# EAGLE design ESP-12F Programming Board-2 (EAGLE 7.6.0)
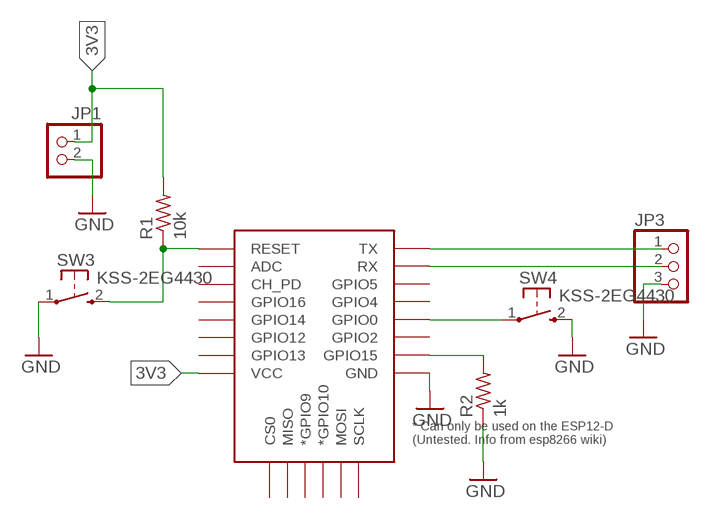
[diagram p0: schematic, sheet 1]

## Parts
JP1  PINHD-1X2  [1X02]
JP3  PINHD-1X3  [1X03]
R1  10k  R-US_R0805  [R0805]
R2  1k  R-US_R0805  [R0805]
SW3  KSS-2EG4430  [KSS-2EG4430]
SW4  KSS-2EG4430  [KSS-2EG4430]
U1  ESP12ESMD  [ESP12E-SMD]

## Nets
3V3: JP1.1 R1.2 U1.VCC
GND: JP1.2 JP3.3 R2.1 SW3.1(P) SW4.2(S) U1.GND
N$1: R1.1 SW3.2(S) U1.RESET
N$2: JP3.2 U1.RXD0(RX)
N$3: JP3.1 U1.TXD0(TX)
N$5: SW4.1(P) U1.GPIO0
N$6: R2.2 U1.GPIO15
Unconnected: U1.ADC U1.CH_PD U1.CS0 U1.GPIO2 U1.GPIO4 U1.GPIO5 U1.GPIO9(*GPIO9) U1.GPIO10(*GPIO10) U1.GPIO12 U1.GPIO13 U1.GPIO14 U1.GPIO16 U1.MISO U1.MOSI U1.SCLK

## Library data of the parts
JP1 = pinhead:PINHD-1X2: PIN HEADER
JP3 = pinhead:PINHD-1X3: PIN HEADER
R1 R2 = rcl:R-US_: RESISTOR, American symbol
SW3 SW4 = sw:KSS-2EG4430: Size: 3x6mm Height: 5mm from PCB Rating: DC12v 50mA Travel: 0.25±0.10mm Operating Force: 180±50gf Return Force: 60gf min Contact resistance: 100m? max Insulation resistance: 100M? min Operating life?50,000 cycles
U1 = esp8266modules:ESP12E: ESP12E Module

## Board
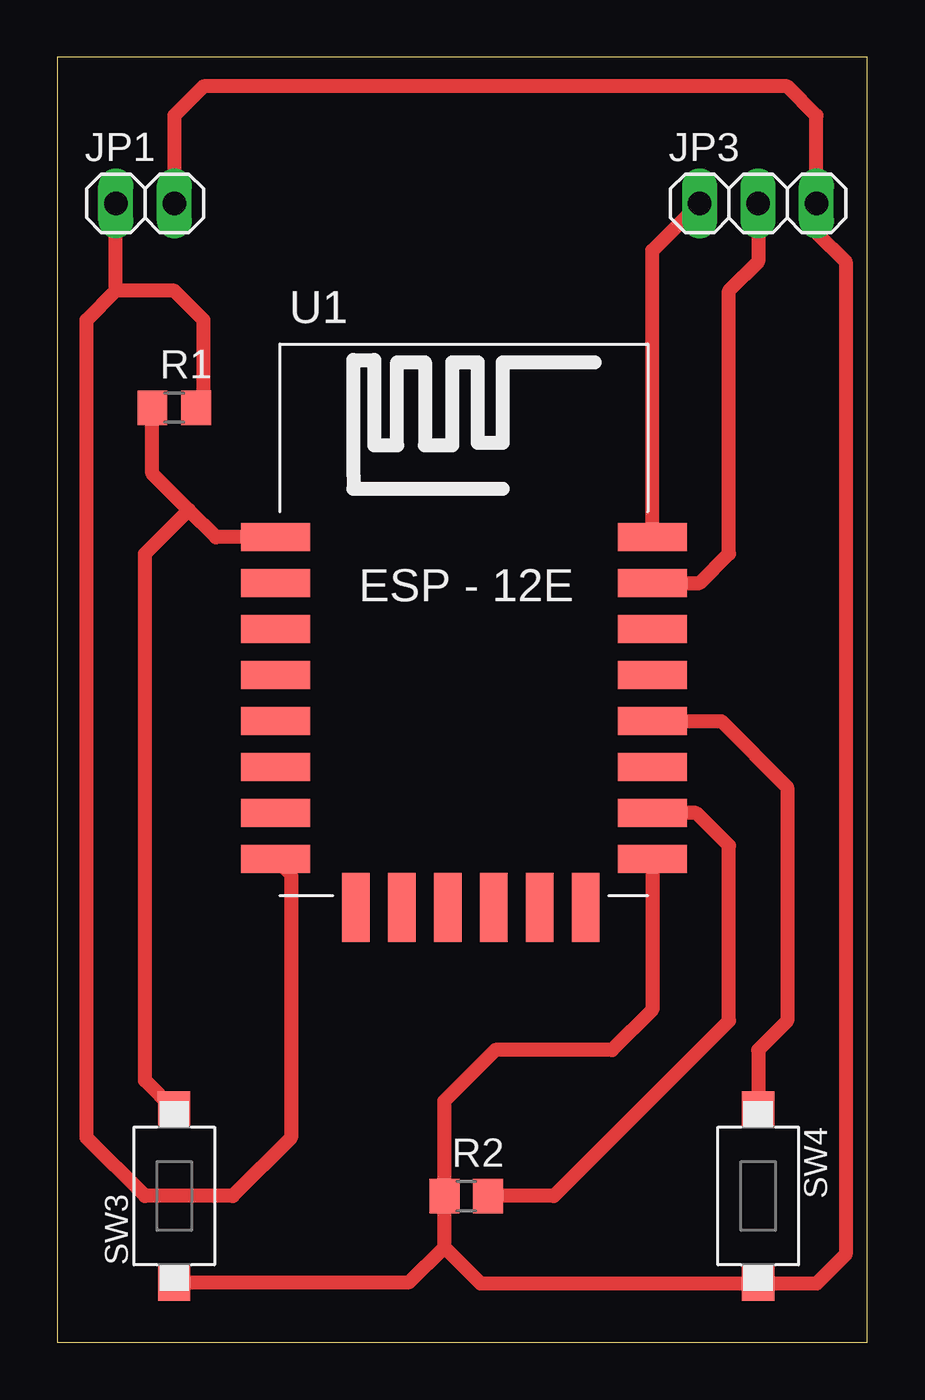
[diagram p1: board, top side]

Size 35.23 x 55.87 mm. Coordinates in mm from the lower left corner, seen from the top.
Outline: 0,0 35.23,0 35.23,55.87 0,55.87 0,0
Copper layers (1*16): Top 0.035mm / dielectric 1.5mm / Bottom 0.035mm
Design rules "default": minimum track width 10mil, minimum drill 24mil, track to track 8mil, track to pad 8mil, pad to pad 8mil, via to via 8mil, smd to smd 8mil, copper to edge 40mil, drill to drill 8mil, minimum pad ring 10mil, minimum via ring 8mil, stop-mask expansion 4mil, vias tented up to drill 0mil, thermal gap 10mil

### Footprints (pad centres in the part's own frame; a part is rotated, then mirrored left to right if it is on the bottom)
1X02 = drill 1.016 long: 1 -1.27,0; 2 1.27,0
1X03 = drill 1.016 long: 1 -2.54,0; 2 0,0; 3 2.54,0
R0805 = smd 1.3 x 1.5: 1 -0.95,0; 2 0.95,0
KSS-2EG4430 = smd 1.6 x 1.4: 1 -3.75,0; 2 3.75,0
ESP12E-SMD = smd 3 x 1.2: ADC -8.3,3.8; CH_PD -8.3,1.8; GND 8.1,-8.2; GPIO0 8.1,-2.2; GPIO2 8.1,-4.2; GPIO4 8.1,-0.2; GPIO5 8.1,1.8; GPIO12 -8.3,-4.2; GPIO13 -8.3,-6.2; GPIO14 -8.3,-2.2; GPIO15 8.1,-6.2; GPIO16 -8.3,-0.2; RESET -8.3,5.8; RXD0 8.1,3.8; TXD0 8.1,5.8; VCC -8.3,-8.2 | smd 1.2 x 3: CS0 -4.8,-10.3; GPIO9 -0.8,-10.3; GPIO10 1.2,-10.3; MISO -2.8,-10.3; MOSI 3.2,-10.3; SCLK 5.2,-10.3

### Placement (x,y rotation side)
JP1  3.81,49.53 0 top
JP3  30.48,49.53 0 top
R1  5.08,40.64 0 top
R2  17.78,6.35 0 top
SW3  5.08,6.35 90 top
SW4  30.48,6.35 270 top
U1  17.78,29.21 0 top

### Tracks (layer width: path | path; a pad name or v marks a point on that pad's centre or on a via)
3V3
  Top 0.61: U1.VCC 10.16,20.33 10.16,8.89 7.62,6.35 3.81,6.35 1.27,8.89 1.27,44.45 2.54,45.72 | 2.54,45.72 JP1.1 | R1.2 6.35,40.96 6.35,44.45 5.08,45.72 2.54,45.72
GND
  Top 0.61: JP1.2 5.08,53.34 6.35,54.61 31.75,54.61 33.02,53.34 JP3.3 33.02,48.26 34.29,46.99 34.29,3.81 33.02,2.54 30.54,2.54 SW4.2 30.42,2.54 18.42,2.54 16.83,4.13 | U1.GND 25.88,14.45 24.13,12.7 19.05,12.7 16.83,10.48 R2.1 16.83,4.13 | SW3.1 15.3,2.6 16.83,4.13
N$1
  Top 0.61: U1.RESET 6.9,35.01 5.71,36.2 | 5.71,36.2 4.13,37.78 R1.1 | SW3.2 3.81,11.37 3.81,34.29 5.71,36.2
N$2
  Top 0.61: U1.RXD0 27.94,33.02 29.21,34.29 29.21,45.72 30.48,46.99 JP3.2
N$3
  Top 0.61: U1.TXD0 25.88,47.47 JP3.1
N$5
  Top 0.61: U1.GPIO0 28.87,27.01 31.75,24.13 31.75,13.97 30.48,12.7 SW4.1
N$6
  Top 0.61: R2.2 21.59,6.35 29.21,13.97 29.21,21.59 27.79,23.01 U1.GPIO15